# Altium project STM32DRONE.PrjPcb
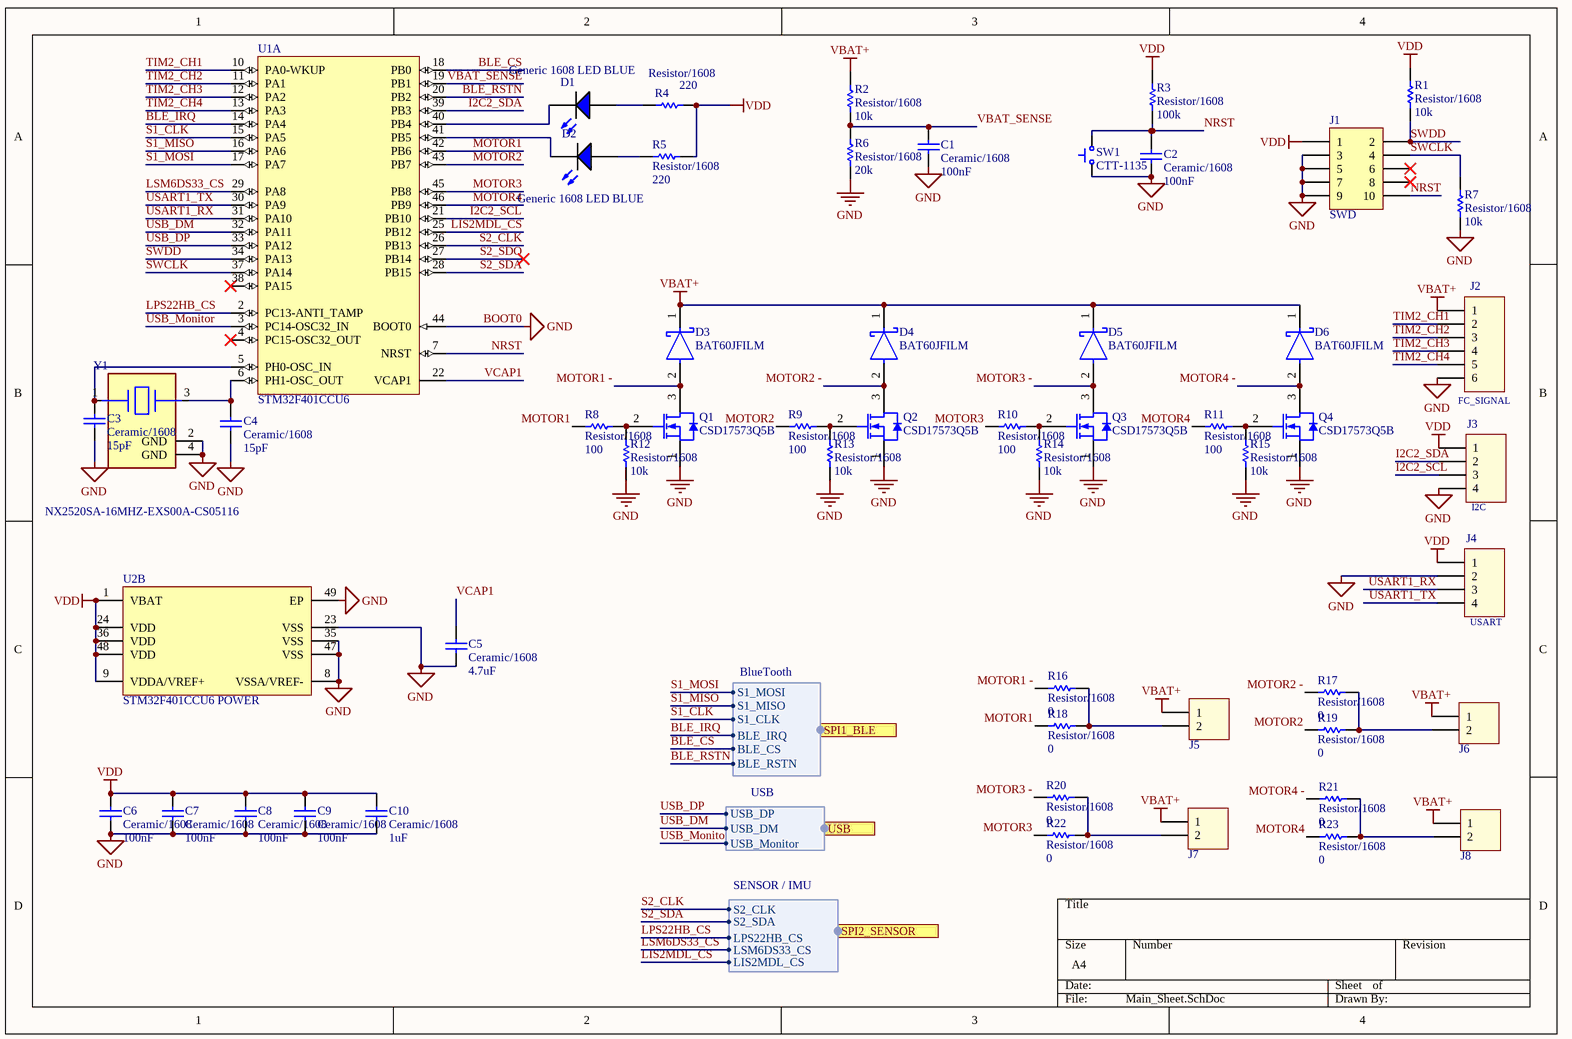
[diagram p0: Main_Sheet.SchDoc]
4 sheets, 89 parts. Net scope: flat (ports and power ports of the same name join across sheets).
Board file: PCB1.PcbDoc
Sheets:
  Main_Sheet.SchDoc
  SPBTLE-RF_BlueTooth_Module.SchDoc
  USB_BAT.SchDoc
  Sensor.SchDoc

## Sheet Main_Sheet.SchDoc
size A4; SheetNumber: 1; SheetTotal: 4

### Parts
C1  Ceramic/1608  value 100nF  [Generic 1608 Ceramic]
C2  Ceramic/1608  value 100nF  [Generic 1608 Ceramic]
C3  Ceramic/1608  value 15pF  [Generic 1608 Ceramic]
C4  Ceramic/1608  value 15pF  [Generic 1608 Ceramic]
C5  Ceramic/1608  value 4.7uF  [Generic 1608 Ceramic]
C6  Ceramic/1608  value 100nF  [Generic 1608 Ceramic]
C7  Ceramic/1608  value 100nF  [Generic 1608 Ceramic]
C8  Ceramic/1608  value 100nF  [Generic 1608 Ceramic]
C9  Ceramic/1608  value 100nF  [Generic 1608 Ceramic]
C10  Ceramic/1608  value 1uF  [Generic 1608 Ceramic]
D1  Generic 1608 LED BLUE  [Generic 1608 LED BLUE-Footprint-1]
D2  Generic 1608 LED BLUE  [Generic 1608 LED BLUE-Footprint-1]
D3  BAT60JFILM  [FP-BAT60JFILM-MFG]
D4  BAT60JFILM  [FP-BAT60JFILM-MFG]
D5  BAT60JFILM  [FP-BAT60JFILM-MFG]
D6  BAT60JFILM  [FP-BAT60JFILM-MFG]
J1  SWD  [3220-10-0300-00-Footprint-1]
J2  FC_SIGNAL  [61300611121]
J3  I2C  [61300411121]
J4  USART  [61300411121]
J5  61300211121  [61300211121]  (value not drawn)
J6  61300211121  [61300211121]  (value not drawn)
J7  61300211121  [61300211121]  (value not drawn)
J8  61300211121  [61300211121]  (value not drawn)
Q1  CSD17573Q5B  [CSD16342Q5A-Footprint-1]
Q2  CSD17573Q5B  [CSD16342Q5A-Footprint-1]
Q3  CSD17573Q5B  [CSD16342Q5A-Footprint-1]
Q4  CSD17573Q5B  [CSD16342Q5A-Footprint-1]
R1  Resistor/1608  value 10k  [Resistor 1608-Footprint]
R2  Resistor/1608  value 10k  [Resistor 1608-Footprint]
R3  Resistor/1608  value 100k  [Resistor 1608-Footprint]
R4  Resistor/1608  value 220  [Resistor 1608-Footprint]
R5  Resistor/1608  value 220  [Resistor 1608-Footprint]
R6  Resistor/1608  value 20k  [Resistor 1608-Footprint]
R7  Resistor/1608  value 10k  [Resistor 1608-Footprint]
R8  Resistor/1608  value 100  [Resistor 1608-Footprint]
R9  Resistor/1608  value 100  [Resistor 1608-Footprint]
R10  Resistor/1608  value 100  [Resistor 1608-Footprint]
R11  Resistor/1608  value 100  [Resistor 1608-Footprint]
R12  Resistor/1608  value 10k  [Resistor 1608-Footprint]
R13  Resistor/1608  value 10k  [Resistor 1608-Footprint]
R14  Resistor/1608  value 10k  [Resistor 1608-Footprint]
R15  Resistor/1608  value 10k  [Resistor 1608-Footprint]
R16  Resistor/1608  value 0  [Resistor 1608-Footprint]
R17  Resistor/1608  value 0  [Resistor 1608-Footprint]
R18  Resistor/1608  value 0  [Resistor 1608-Footprint]
R19  Resistor/1608  value 0  [Resistor 1608-Footprint]
R20  Resistor/1608  value 0  [Resistor 1608-Footprint]
R21  Resistor/1608  value 0  [Resistor 1608-Footprint]
R22  Resistor/1608  value 0  [Resistor 1608-Footprint]
R23  Resistor/1608  value 0  [Resistor 1608-Footprint]
SW1  CTT-1135  [CTT-1135-Footprint-1]
U1  STM32F401CCU6  [STM-UFQFPN48_N]  (part A of 2)
U2  STM32F401CCU6 POWER  [STM-UFQFPN48_N]  (part B of 2)
Y1  NX2520SA-16MHZ-EXS00A-CS05116  [FP-NX2520SA-MFG]

### Ports
SPI1_BLE (harness BlueTooth), SPI2_SENSOR (harness SENSOR / IMU), USB (harness USB)

### Harnesses
BlueTooth: S1_CLK, S1_MISO, S1_MOSI, BLE_IRQ, BLE_CS, BLE_RSTN
USB: USB_DM, USB_DP, USB_Monitor
SENSOR / IMU: LPS22HB_CS, S2_SDA, S2_CLK, LSM6DS33_CS, LIS2MDL_CS

### Nets
BOOT0: C1.1 C2.1 C3.1 C4.1 C5.1 C6.1 C6.2 C7.1 C7.2 C8.1 C8.2 C9.1 C9.2 C10.1 C10.2 J1.1 J1.3 J1.5 J1.7 J1.9 J2.6 J3.1 J3.4 J4.1 J4.2 Q1.1(S) Q2.1(S) Q3.1(S) Q4.1(S) R1.2 R3.2 R4.2 R5.2 R6.1 R7.1 R12.1 R13.1 R14.1 R15.1 SW1.1 U1.44(BOOT0) U2.1(VBAT) U2.8(VSSA/VREF-) U2.9(VDDA/VREF+) U2.23(VSS) U2.24(VDD) U2.35(VSS) U2.36(VDD) U2.47(VSS) U2.48(VDD) U2.49(EP) Y1.2(GND) Y1.4(GND)  [also labelled GND, VDD]
VBAT+: D3.1(K) D4.1(K) D5.1(K) D6.1(K) J2.1 J5.1 J6.1 J7.1 J8.1 R2.2
BLE_CS: U1.18(PB0) ; port SPI1_BLE.BLE_CS
BLE_IRQ: U1.14(PA4) ; port SPI1_BLE.BLE_IRQ
BLE_RSTN: U1.20(PB2) ; port SPI1_BLE.BLE_RSTN
I2C2_SCL: J3.3 U1.21(PB10)
I2C2_SDA: J3.2 U1.39(PB3)
LIS2MDL_CS: U1.25(PB12) ; port SPI2_SENSOR.LIS2MDL_CS
LPS22HB_CS: U1.2(PC13-ANTI_TAMP) ; port SPI2_SENSOR.LPS22HB_CS
LSM6DS33_CS: U1.29(PA8) ; port SPI2_SENSOR.LSM6DS33_CS
MOTOR1: R8.1 R18.1 U1.42(PB6)
MOTOR1 -: D3.2(A) Q1.3(D) R16.1
MOTOR2: R9.1 R19.1 U1.43(PB7)
MOTOR2 -: D4.2(A) Q2.3(D) R17.1
MOTOR3: R10.1 R22.1 U1.45(PB8)
MOTOR3 -: D5.2(A) Q3.3(D) R20.1
MOTOR4: R11.1 R23.1 U1.46(PB9)
MOTOR4 -: D6.2(A) Q4.3(D) R21.1
NRST: C2.2 J1.10 R3.1 SW1.2 U1.7(NRST)
S1_CLK: U1.15(PA5) ; port SPI1_BLE.S1_CLK  [project net CLK]
S1_MISO: U1.16(PA6) ; port SPI1_BLE.S1_MISO  [project net MISO]
S1_MOSI: U1.17(PA7) ; port SPI1_BLE.S1_MOSI  [project net MOSI]
S2_CLK: U1.26(PB13) ; port SPI2_SENSOR.S2_CLK
S2_SDA: U1.28(PB15) ; port SPI2_SENSOR.S2_SDA
S2_SDO: U1.27(PB14)
SWCLK: J1.4 R7.2 U1.37(PA14)
SWDD: J1.2 R1.1 U1.34(PA13)
TIM2_CH1: J2.2 U1.10(PA0-WKUP)
TIM2_CH2: J2.3 U1.11(PA1)
TIM2_CH3: J2.4 U1.12(PA2)
TIM2_CH4: J2.5 U1.13(PA3)
USART1_RX: J4.3 U1.31(PA10)
USART1_TX: J4.4 U1.30(PA9)
USB_DM: U1.32(PA11) ; port USB.USB_DM
USB_DP: U1.33(PA12) ; port USB.USB_DP
USB_Monitor: U1.3(PC14-OSC32_IN) ; port USB.USB_Monitor
VBAT_SENSE: C1.2 R2.1 R6.2 U1.19(PB1)
VCAP1: C5.2 U1.22(VCAP1)
NetC3_2: C3.2 U1.5(PH0-OSC_IN) Y1.1
NetC4_2: C4.2 U1.6(PH1-OSC_OUT) Y1.3
NetD1_1: D1.1(A) R4.1
NetD1_2: D1.2(K) U1.40(PB4)
NetD2_1: D2.1(A) R5.1
NetD2_2: D2.2(K) U1.41(PB5)
NetJ5_2: J5.2 R16.2 R18.2
NetJ6_2: J6.2 R17.2 R19.2
NetJ7_2: J7.2 R20.2 R22.2
NetJ8_2: J8.2 R21.2 R23.2
NetQ1_2: Q1.2(G) R8.2 R12.2
NetQ2_2: Q2.2(G) R9.2 R13.2
NetQ3_2: Q3.2(G) R10.2 R14.2
NetQ4_2: Q4.2(G) R11.2 R15.2

Not connected (* = marked no-connect by the designer): J1 6* 8*; U1 4(PC15-OSC32_OUT)* 38(PA15)*

### Library data of the parts
C1-C10 = CMP-002-0009-3: Generic 1608 Ceramic Capacitor; Capacitor Type: Ceramic; Pins: 2; Mount: SMD; Case/Package: 1608; RoHS: Yes
D1 D2 = CMP-008-0003-2: Generic 1608 LED <BLUE>
D3-D6 = CMP-12187-000028-1: DIODE SCHOTTKY 10V 3A SOD323; Max Forward Surge Current (Ifsm): 5A; Forward Voltage: 580mV; Max Reverse Leakage Current: 7.5uA; Element Configuration: Single; Polarity: Standard; Output Current: 3A; Contact Plating: Tin; Package Quantity: 1; Mount: Surface Mount; Min Operating Temperature: -65°C; Average Rectified Current: 3A; Packaging: Tape and Reel; Forward Current: 3A; Height: 1.07mm; Length: 1.8mm; REACH SVHC: No SVHC; Peak Non-Repetitive Surge Current: 5A; Max Surge Current: 5A; Width: 1.45mm; Current Rating: 3A; Lead Free: Lead Free; Radiation Hardening: No; Max Reverse Voltage (DC): 10V; Peak Reverse Current: 7.5uA; Voltage Rating (DC): 10V; Max Operating Temperature: 150°C; Max Repetitive Reverse Voltage (Vrrm): 10V; Number of Pins: 2; Weight: 0.01lb
J1 = CMP-ROOT-00062-1: CONN HEADER SMD 10POS 1.27MM; Pitch: 0.05inch; Number of Positions: 10; Connector Type: Male Pin; Mount: Surface Mount; Packaging: Tray; Contact Plating: Gold; Termination: Solder; Number of Rows: 2; RoHS: Yes; Package Quantity: 3200; Row Spacing: 0.05inch
J2 = CMP-005-0062-1: Pin Header WR-PHD, pitch 2.54 mm, THT, Vertical, single row, 6 pin; Contact Resistance: 20 mOhm; Insulation Resistance: >1000 MOhm; Pin Number: 6; Pitch: 2.54 mm; Rated Current: 3 A; Working Voltage: 250 VAC; Component Name: 61300611121; ComponentLink1Description: Manufacturer; ComponentLink1URL: http://www.we-online.de; ComponentLink2Description: Datasheet; ComponentLink2URL: http://katalog.we-online.de/em/datasheet/6130xx11121.pdf; Designator: 61300611121; Mounting Technology: THT; Operating Temperature: -40 to 105 degC; Orientation: Vertical; Part Number: 61300611121; Pin Count: 6; Published Date: Jan. 2018; Publisher: Wurth Elektronik; Row Number: Single
J3 J4 = CMP-005-0056-1: Pin Header WR-PHD, pitch 2.54 mm, THT, Vertical, single row, 4 pin; Contact Resistance: 20 mOhm; Insulation Resistance: >1000 MOhm; Pin Number: 4; Pitch: 2.54 mm; Rated Current: 3 A; Working Voltage: 250 VAC; Component Name: 61300411121; ComponentLink1Description: Manufacturer; ComponentLink1URL: http://www.we-online.de; ComponentLink2Description: Datasheet; ComponentLink2URL: http://katalog.we-online.de/em/datasheet/6130xx11121.pdf; Designator: 61300411121; Mounting Technology: THT; Operating Temperature: -40 to 105 degC; Orientation: Vertical; Part Number: 61300411121; Pin Count: 4; Published Date: Jan. 2018; Publisher: Wurth Elektronik; Row Number: Single
J5-J8 = CMP-005-0052-1: Pin Header WR-PHD, pitch 2.54 mm, THT, Vertical, single row, 2 pin; Contact Resistance: 20 mOhm; Insulation Resistance: >1000 MOhm; Pin Number: 2; Pitch: 2.54 mm; Rated Current: 3 A; Working Voltage: 250 VAC; Component Name: 61300211121; ComponentLink1Description: Manufacturer; ComponentLink1URL: http://www.we-online.de; ComponentLink2Description: Datasheet; ComponentLink2URL: http://katalog.we-online.de/em/datasheet/6130xx11121.pdf; Designator: 61300211121; Mounting Technology: THT; Operating Temperature: -40 to 105 degC; Orientation: Vertical; Part Number: 61300211121; Pin Count: 2; Published Date: Jan. 2018; Publisher: Wurth Elektronik; Row Number: Single
Q1-Q4 = CMP-014-0005-2: Trans MOSFET N-CH 30V 100A 8-Pin SON T/R; pin to pad: 1>1+2+3 2>4 3>5+6+7+8; Turn-On Delay Time: 6ns; Max Power Dissipation: 3.2W; Rds On Max: 1mR; Turn-Off Delay Time: 40ns; Gate to Source Voltage (Vgs): 20V; Input Capacitance: 9nF; Element Configuration: Single; Rise Time: 20ns; Fall Time: 7ns; Max Operating Temperature: 150°C; Contact Plating: Nickel, Gold; Mount: Surface Mount; Lead Free: Contains Lead; Number of Pins: 8; Drain to Source Voltage (Vdss): 30V; Continuous Drain Current (ID): 100A; Packaging: Tape and Reel; Min Operating Temperature: -55°C
R1-R23 = CMP-001-0018-2: Generic 1608 Resistor; Pins: 2; Case/Package: Bulk; RoHS: Yes; Mount: SMD
SW1 = CMP-013-0003-1: 3.9x2.9x2.0 SMD  Tact switch; RoHS: Yes; Case/Package: 3.9x2.9x2.0; Mount: SMD; Pins: 2
U1 U2 = CMP-0243-00119-2: ARM Cortex-M4 32-bit MCU+FPU, 105 DMIPS, 256 kB Flash, 64 kB Internal RAM, 36 I/Os, 48-pin UFQFPN, -40 to 85 degC, Tray; Manufacturer: STMicroelectronics; Supply Voltage(Vcc) max (V): 3.6; I/Os (High Current): 36; Internal RAM Size (kB): 64; Operating Frequency(F) (Processor speed) (MHz): 84; FLASH Size (Prog) (kB): 256; Supply Voltage(Vcc) min (V): 1.8; Packing: Tray; PackageReference: UFQFPN48; PackageVersion: Rev. 1, 04/2013; Core: ARM Cortex-M4; ComponentLink1Description: Manufacturer URL; ComponentLink3Description: Package Specification; PackageDescription: 48-Pin Ultra Thin Fine Pitch Quad Flat No-Lead, 7 x 7 x 0.6 mm Body, 0.5 mm Pitch, Exposed Pad; Mounting Technology: Surface Mount; ComponentLink2URL: http://www.st.com/st-web-ui/static/active/en/resource/technical/document/data_brief/DM00071938.pdf; DatasheetVersion: Rev. 1; ComponentLink2Description: Datasheet; ComponentLink1URL: http://www.st.com/web/en/home.html; PartNumber: STM32F401CCU6; ComponentLink3URL: http://www.st.com/st-web-ui/static/active/en/resource/technical/document/data_brief/DM00071938.pdf
Y1 = CMP-2000-05279-2: CRYSTAL 16.0000MHZ 12PF SMD; Series Resistance: 80R; Frequency: 16MHz; Frequency Tolerance: 15ppm; Frequency Stability: 25ppm; Mount: Surface Mount; Height: 0.022inch; Length: 0.098inch; ESR (Equivalent Series Resistance): 80R; Packaging: Tape and Reel; Min Operating Temperature: -40°C; Width: 0.079inch; Number of Pins: 4; Case/Package: SMD/SMT; Max Operating Temperature: 85°C; Load Capacitance: 12pF; Package Quantity: 3000

## Sheet SPBTLE-RF_BlueTooth_Module.SchDoc
size A4; SheetNumber: 2; SheetTotal: 4
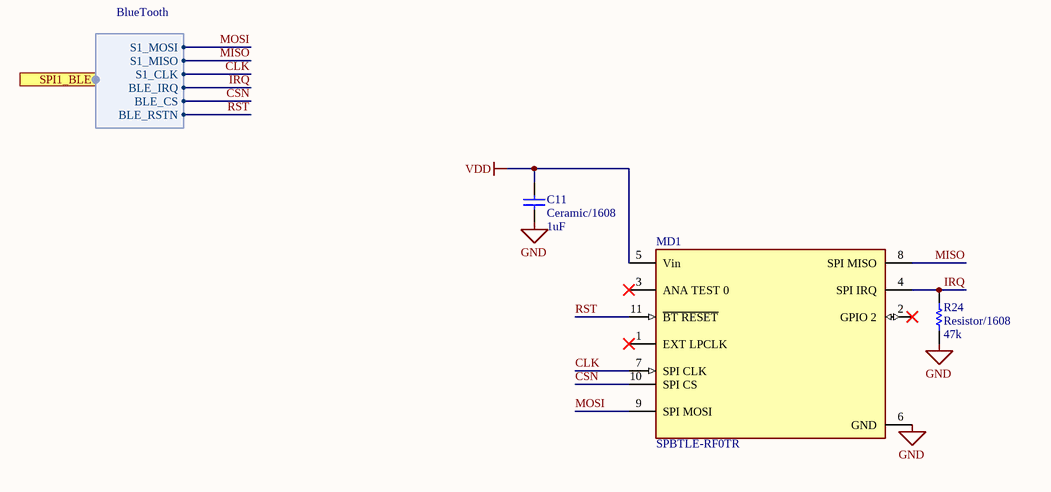
[diagram p1: SPBTLE-RF_BlueTooth_Module.SchDoc]

### Parts
C11  Ceramic/1608  value 1uF  [Generic 1608 Ceramic]
MD1  SPBTLE-RF0TR  [FP-SPBTLE-RF0TR-MFG]
R24  Resistor/1608  value 47k  [Resistor 1608-Footprint]

### Ports
SPI1_BLE (harness BlueTooth)

### Harnesses
BlueTooth: S1_CLK, S1_MISO, S1_MOSI, BLE_IRQ, BLE_CS, BLE_RSTN

### Nets
GND: C11.1 C11.2 MD1.5(Vin) MD1.6(GND) R24.1  [also labelled VDD]  [project net BOOT0]
CLK: MD1.7(SPI_CLK) ; port SPI1_BLE.S1_CLK
CSN: MD1.10(SPI_CS) ; port SPI1_BLE.BLE_CS  [project net BLE_CS]
IRQ: MD1.4(SPI_IRQ) R24.2 ; port SPI1_BLE.BLE_IRQ  [project net BLE_IRQ]
MISO: MD1.8(SPI_MISO) ; port SPI1_BLE.S1_MISO
MOSI: MD1.9(SPI_MOSI) ; port SPI1_BLE.S1_MOSI
RST: MD1.11(~{BT_RESET}) ; port SPI1_BLE.BLE_RSTN  [project net BLE_RSTN]

Not connected (* = marked no-connect by the designer): MD1 1(EXT_LPCLK)* 2(GPIO_2)* 3(ANA_TEST_0)*

### Library data of the parts
C11 = CMP-002-0009-3: Generic 1608 Ceramic Capacitor; Capacitor Type: Ceramic; Pins: 2; Mount: SMD; Case/Package: 1608; RoHS: Yes
MD1 = CMP-12160-000004-1: MOD VLP BLUETOOTH REV V4.1; Manufacturer: STMicroelectronics; Sensitivity: -88dBm; Nominal Supply Current: 0.186-14.49mA; Number Of Gpio: 1; Max Frequency: 2480MHz; Interface: SPI; Max Supply Voltage: 3.6V; Min Supply Voltage: 1.7V; Category: UNK; ComponentLink2URL: https://www.st.com/resource/en/datasheet/spbtle-rf0.pdf; Temperature Range Low: -40°C; Package: SPBTLE-RF0TR; Lead Free: Yes; Device Class L3: Transceivers; RoHS: TRUE; Height: 2.2mm; Manufacturer Part Number: SPBTLE-RF0TR; Temperature Range High: +85°C; ComponentLink2Description: Datasheet; Device Class L2: RF Semiconductors and Devices; Automotive: No; Device Class L1: Integrated Circuits (ICs); Digikey Description: MOD VLP BLUETOOTH REV V4.1; Octopart: https://octopart.com/spbtle-rf0tr-stmicroelectronics-87775406; Temperature: -40°C to +85°C
R24 = CMP-001-0018-2: Generic 1608 Resistor; Pins: 2; Case/Package: Bulk; RoHS: Yes; Mount: SMD

## Sheet USB_BAT.SchDoc
size A4; SheetNumber: 3; SheetTotal: 4
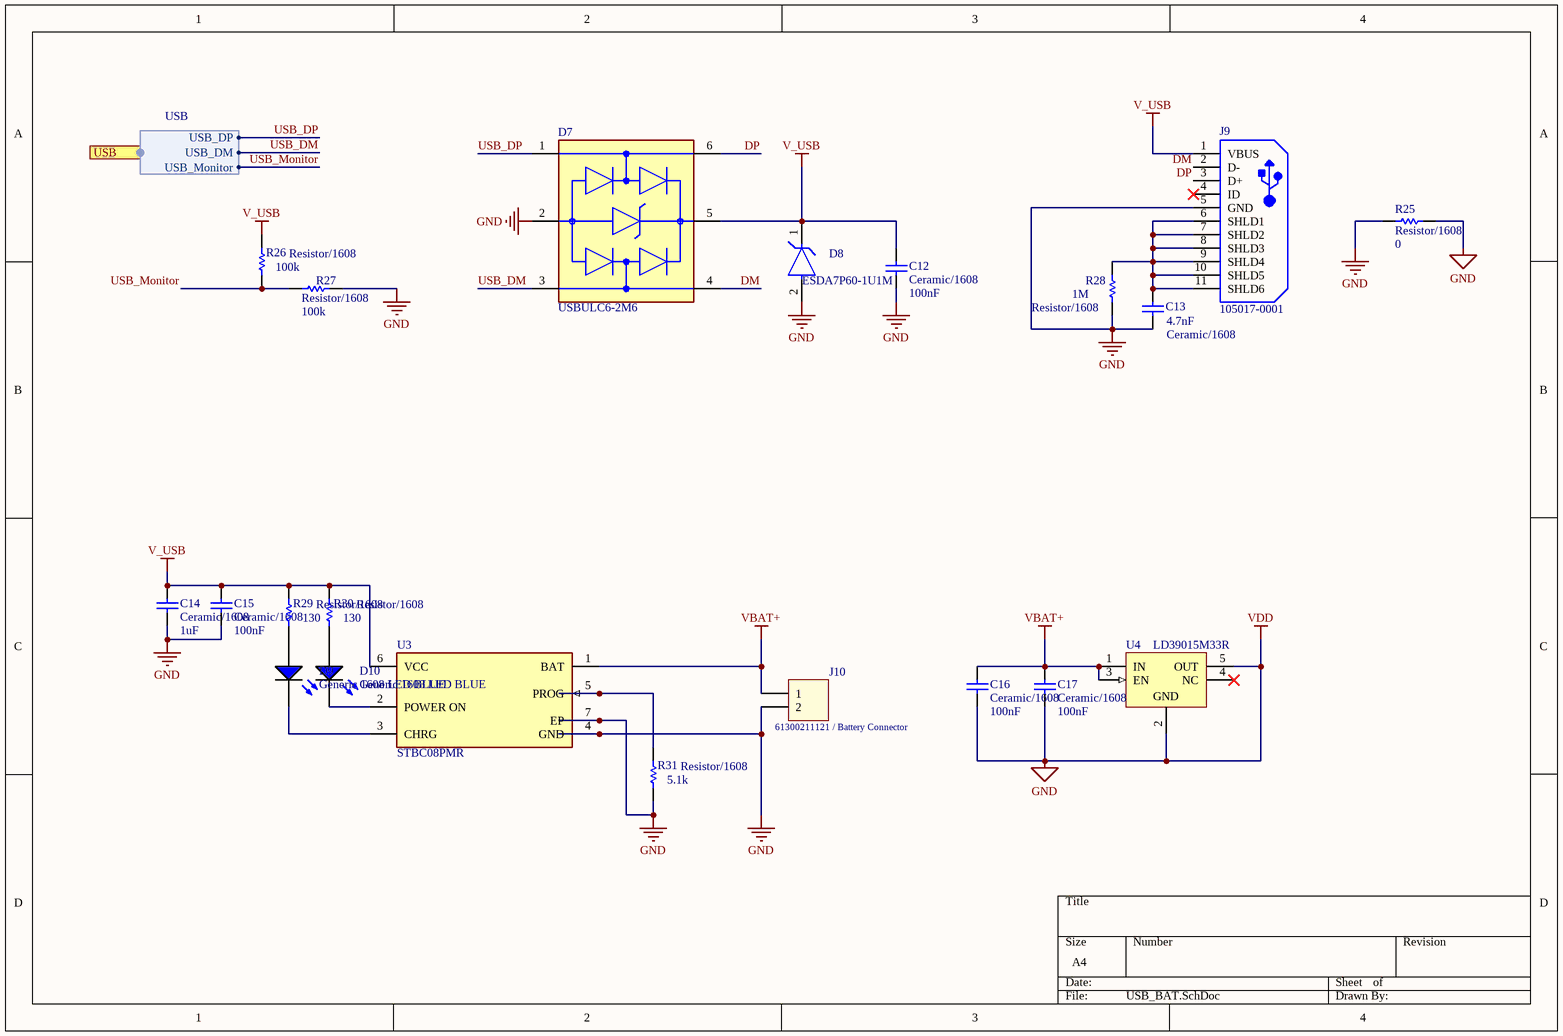
[diagram p2: USB_BAT.SchDoc]

### Parts
C12  Ceramic/1608  value 100nF  [Generic 1608 Ceramic]
C13  Ceramic/1608  value 4.7nF  [Generic 1608 Ceramic]
C14  Ceramic/1608  value 1uF  [Generic 1608 Ceramic]
C15  Ceramic/1608  value 100nF  [Generic 1608 Ceramic]
C16  Ceramic/1608  value 100nF  [Generic 1608 Ceramic]
C17  Ceramic/1608  value 100nF  [Generic 1608 Ceramic]
D7  USBULC6-2M6  [FP-QFN_1_45x1_00_6L-MFG]
D8  ESDA7P60-1U1M  [FP-1610-MFG]
D9  Generic 1608 LED BLUE  [Generic 1608 LED BLUE-Footprint-1]
D10  Generic 1608 LED BLUE  [Generic 1608 LED BLUE-Footprint-1]
J9  105017-0001  [USB-MICRO-B_V]
J10  61300211121 / Battery Connector  [61300211121]
R25  Resistor/1608  value 0  [Resistor 1608-Footprint]
R26  Resistor/1608  value 100k  [Resistor 1608-Footprint]
R27  Resistor/1608  value 100k  [Resistor 1608-Footprint]
R28  Resistor/1608  value 1M  [Resistor 1608-Footprint]
R29  Resistor/1608  value 130  [Resistor 1608-Footprint]
R30  Resistor/1608  value 130  [Resistor 1608-Footprint]
R31  Resistor/1608  value 5.1k  [Resistor 1608-Footprint]
U3  STBC08PMR  [FP-DFN6-7946637-IPC_A]
U4  LD39015M33R  [SOT23-5L_M]

### Ports
USB (harness USB)

### Harnesses
USB: USB_DM, USB_DP, USB_Monitor

### Nets
GND: C12.1 C13.1 C14.1 C15.1 C16.1 C17.1 D7.2 D8.2(A) J9.5(GND) J10.2 R25.1 R25.2 R27.1 R28.1 R31.1 U3.4(GND) U3.7(EP) U4.2(GND) U4.5(OUT)  [also labelled VDD]  [project net BOOT0]
V_USB: C12.2 C14.2 C15.2 D7.5 D8.1(C) J9.1(VBUS) R26.2 R29.2 R30.2 U3.6(VCC)
VBAT+: C16.2 C17.2 J10.1 U3.1(BAT) U4.1(IN) U4.3(EN)
DM: D7.4(I/O2) J9.2(D-)
DP: D7.6(I/O1) J9.3(D+)
USB_DM: D7.3(I/O2) ; port USB.USB_DM
USB_DP: D7.1(I/O1) ; port USB.USB_DP
USB_Monitor: R26.1 R27.2 ; port USB.USB_Monitor
NetC13_2: C13.2 J9.6(SHLD1) J9.7(SHLD2) J9.8(SHLD3) J9.9(SHLD4) J9.10(SHLD5) J9.11(SHLD6) R28.2
NetD9_1: D9.1(A) R29.1
NetD9_2: D9.2(K) U3.3(CHRG)
NetD10_1: D10.1(A) R30.1
NetD10_2: D10.2(K) U3.2(POWER_ON)
NetR31_2: R31.2 U3.5(PROG)

Not connected (* = marked no-connect by the designer): J9 4(ID)*; U4 4(NC)*

### Library data of the parts
C12 C14-C17 = CMP-002-0009-3: Generic 1608 Ceramic Capacitor; Capacitor Type: Ceramic; Pins: 2; Mount: SMD; Case/Package: 1608; RoHS: Yes
C13 = CMP-002-0009-3: Generic 1608 Ceramic Capacitor / 50V; Capacitor Type: Ceramic; Pins: 2; Mount: SMD; Case/Package: 1608; RoHS: Yes
D7 = CMP-12225-000002-1: TVS DIODE 5V 17V 6UQFN; Manufacturer: STMicroelectronics; Breakdown Voltage: 6V; Direction: Unidirectional; Capacitance: 0.65pF; Number Of Channels: 2; Max Junction Temp: +150°C; Value: 0.65pF; Standoff Height: 0mm; Package: QFN_1.45x1.00_6L; Digikey Description: TVS DIODE 5V 17V 6UQFN; Temperature Range High: +150°C; Device Class L2: TVS Diodes; ComponentLink2Description: Datasheet; Device Class L1: Circuit Protection; Temperature: to +150°C; RoHS: TRUE; Ipc Land Pattern Name: DFN145X100X57-6; Manufacturer Part Number: USBULC6-2M6; Category: Diode; Automotive: No; ComponentLink2URL: https://www.st.com/resource/en/datasheet/usbulc6-2m6.pdf; Lead Free: Yes; Device Class L3: unset; Clamping Voltage: 17V; Mouser Description: ESD Suppressors ULTRA LG BANDWIDTH ESD PROTECTION; Octopart: https://octopart.com/usbulc6-2m6-stmicroelectronics-7979994; Height: 0.65mm
D8 = CMP-12225-000013-1: TVS DIODE 5V 11.6V 1610; Manufacturer: STMicroelectronics; Number Of Channels: 1; Standoff Height: 0mm; Breakdown Voltage: 6.4V; Direction: Unidirectional; Clamping Voltage: 10.2V; Peak Pulse Power: 700W; Peak Pulse Current: 60A; Max Junction Temp: +150°C; ComponentLink2Description: Datasheet; Temperature Range Low: -55°C; Package: 1610; Lead Free: Yes; Temperature Range High: +150°C; Temperature: -55°C to +150°C; Device Class L2: TVS Diodes; Category: Diode; Device Class L1: Circuit Protection; Manufacturer Part Number: ESDA7P60-1U1M; Digikey Description: TVS DIODE 5V 11.6V 1610; ComponentLink2URL: http://www.st.com/content/ccc/resource/technical/document/datasheet/44/e9/26/44/42/ee/4f/e5/DM00139972.pdf/files/DM00139972.pdf/jcr:content/translations/en.DM00139972.pdf; Reverse Standoff Voltage: 5V; RoHS: TRUE; Octopart: https://octopart.com/esda7p60-1u1m-stmicroelectronics-52112702; Height: 0.65mm; Device Class L3: unset; Automotive: No
D9 D10 = CMP-008-0003-2: Generic 1608 LED <BLUE>
J9 = CMP-2000-05827-1: Micro-USB B Receptacle, Right Angle, Bottom Mount, Surface Mount, with Solder Tabs, -30 to 85 degC, 5-Pin USB, RoHS, Tape and Reel; Manufacturer: Molex; Featured Product: Micro-USBConnectorsUSBConnectors; Other Names: WM1399DKR; Package Version: Rev. F, 12/2012; Number of Contacts: 5; Connector Type: USB-microB; Catalog Drawings: 1050170001; 3D Model: 105017-0001.stp; Mating Products: WM17145-ND-CABLEMICROUSBBTOSTDA1.0MWM17147-ND-CABLEMICROUSBBTOSTDA2.0MWM17146-ND-CABLEMICROUSBBTOSTDA1.5M; PCN Assembly/Origin: ResinSupplier21/Oct/2015; Voltage - Max: 30V; Online Catalog: Molex-MicroUSB; Manufacturer URL: http://www.molex.com/; Package Description: 5-Leads USB, Micro B, Body 7.5 x 5 mm, Pitch 0.65 mm; Datasheet URL: http://www.molex.com/elqNow/elqRedir.htm?ref=http://www.molex.com/webdocs/datasheets/pdf/en-us/1050170001_IO_CONNECTORS.pdf; Ingress Protection: -; Datasheet Version: 03/2016; Mounting Type: BoardCutout,SurfaceMount,RightAngle; Circuits: 5; Standard Package: 1; Package Reference: MICRO-B; Package URL: http://www.molex.com/pdm_docs/sd/1050170001_sd.pdf; Category: Connectors,Interconnects; Series: -; RoHS Information: 1050170001CertofCompliance; Features: Shielded,SolderRetention; Family: USB,DVI,HDMIConnectors; Specifications: -; Gender: Receptacle; Packaging: Digi-Reel®; Mounting Technology: SurfaceMount
J10 = CMP-005-0052-1: as J5 on sheet Main_Sheet; Component Name: 61300211121; ComponentLink1Description: Manufacturer; ComponentLink1URL: http://www.we-online.de; ComponentLink2Description: Datasheet; ComponentLink2URL: http://katalog.we-online.de/em/datasheet/6130xx11121.pdf; Designator: 61300211121; Mounting Technology: THT; Operating Temperature: -40 to 105 degC; Orientation: Vertical; Part Number: 61300211121; Pin Count: 2; Published Date: Jan. 2018; Publisher: Wurth Elektronik; Row Number: Single
R25-R31 = CMP-001-0018-2: Generic 1608 Resistor; Pins: 2; Case/Package: Bulk; RoHS: Yes; Mount: SMD
U3 = CMP-12147-000003-2: IC BATT CHRGR LI-ION 800MA DFN6; Max Input Voltage: 10V; Min Supply Voltage: 4.25V; Min Output Voltage: 4.158V; Max Output Voltage: 4.242V; Number of Channels: 1; Max Supply Voltage: 6.5V; Output Voltage: 4.2V; Case/Package: DFN; Length: 3.1mm; Width: 3.1mm; Packaging: Tape and Reel; Output Current: 800mA; Min Operating Temperature: -40°C; Mount: Surface Mount; Height: 0.95mm; Radiation Hardening: No; Lead Free: Lead Free; Max Output Current: 800mA; Max Operating Temperature: 85°C; Number of Pins: 6; Package Quantity: 1
U4 = CMP-0244-00351-1: 150 mA Low Quiescent Current Low Noise Voltage Regulator, 3.3V, 5-Pin SOT-23, Tape and Reel; PackageReference: SOT23-5L; ComponentLink1URL: http://www.st.com; PackageDescription: 5-Pin SOT-23 Package, 2.9 x 1.6 mm Body, 0.95 mm Pitch, 2.8 mm Lead Span; ComponentLink2Description: Datasheet; DatasheetVersion: 1/02/2009; ComponentLink1Description: Manufacturer URL; ComponentLink2URL: http://www.st.com/internet/com/TECHNICAL_RESOURCES/TECHNICAL_LITERATURE/DATASHEET/CD00173477.pdf; PackageVersion: 1/01/2008

## Sheet Sensor.SchDoc
size A4; SheetNumber: 4; SheetTotal: 4
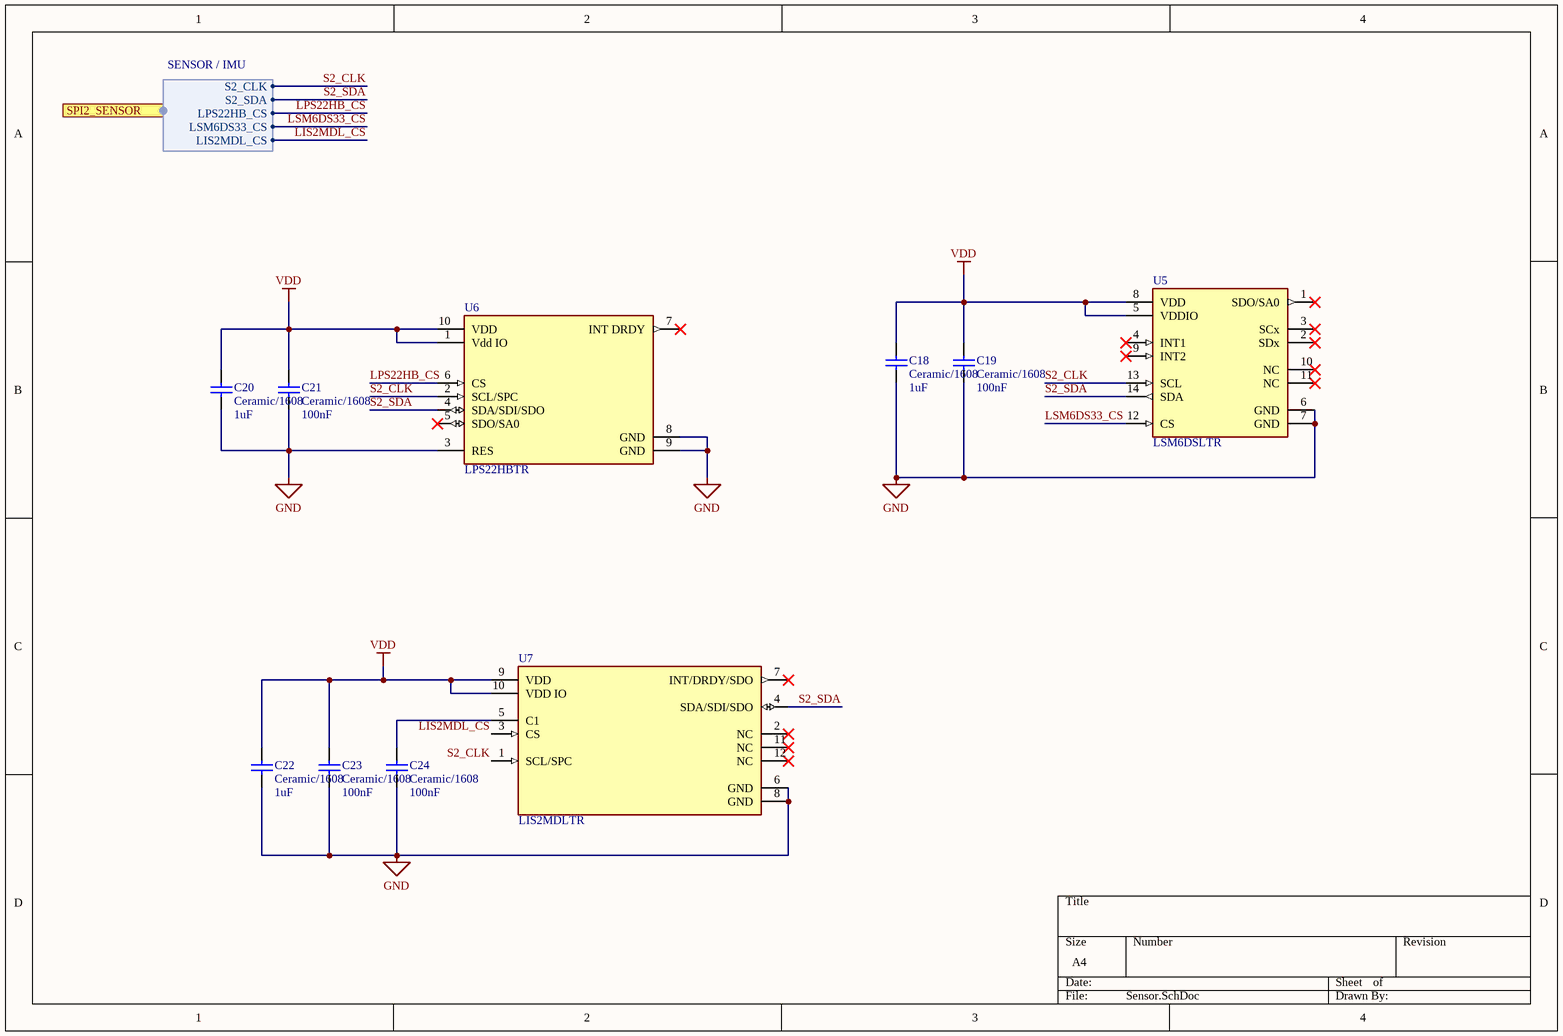
[diagram p3: Sensor.SchDoc]

### Parts
C18  Ceramic/1608  value 1uF  [Generic 1608 Ceramic]
C19  Ceramic/1608  value 100nF  [Generic 1608 Ceramic]
C20  Ceramic/1608  value 1uF  [Generic 1608 Ceramic]
C21  Ceramic/1608  value 100nF  [Generic 1608 Ceramic]
C22  Ceramic/1608  value 1uF  [Generic 1608 Ceramic]
C23  Ceramic/1608  value 100nF  [Generic 1608 Ceramic]
C24  Ceramic/1608  value 100nF  [Generic 1608 Ceramic]
U5  LSM6DSLTR  [FP-LGA-14L-DM00249496-MFG]
U6  LPS22HBTR  [FP-HLGA-10L-8479831-0]
U7  LIS2MDLTR  [FP-LGA-12-DM00170568-MFG]

### Ports
SPI2_SENSOR (harness SENSOR / IMU)

### Harnesses
SENSOR / IMU: LPS22HB_CS, S2_SDA, S2_CLK, LSM6DS33_CS, LIS2MDL_CS

### Nets
GND: C18.1 C18.2 C19.1 C19.2 C20.1 C20.2 C21.1 C21.2 C22.1 C22.2 C23.1 C23.2 C24.2 U5.5(VDDIO) U5.6(GND) U5.7(GND) U5.8(VDD) U6.1(Vdd_IO) U6.3(RES) U6.8(GND) U6.9(GND) U6.10(VDD) U7.6(GND) U7.8(GND) U7.9(VDD) U7.10(VDD_IO)  [also labelled VDD]  [project net BOOT0]
LIS2MDL_CS: U7.3(CS) ; port SPI2_SENSOR.LIS2MDL_CS
LPS22HB_CS: U6.6(CS) ; port SPI2_SENSOR.LPS22HB_CS
LSM6DS33_CS: U5.12(CS) ; port SPI2_SENSOR.LSM6DS33_CS
S2_CLK: U5.13(SCL) U6.2(SCL/SPC) U7.1(SCL/SPC) ; port SPI2_SENSOR.S2_CLK
S2_SDA: U5.14(SDA) U6.4(SDA/SDI/SDO) U7.4(SDA/SDI/SDO) ; port SPI2_SENSOR.S2_SDA
NetC24_1: C24.1 U7.5(C1)

Not connected (* = marked no-connect by the designer): U5 1(SDO/SA0)* 2(SDx)* 3(SCx)* 4(INT1)* 9(INT2)* 10(NC)* 11(NC)*; U6 5(SDO/SA0)* 7(INT_DRDY)*; U7 2(NC)* 7(INT/DRDY/SDO)* 11(NC)* 12(NC)*

### Library data of the parts
C18-C24 = CMP-002-0009-3: Generic 1608 Ceramic Capacitor; Capacitor Type: Ceramic; Pins: 2; Mount: SMD; Case/Package: 1608; RoHS: Yes
U5 = CMP-2000-07467-2: IMU ACCEL/GYRO I2C/SPI 14LGA; Manufacturer: STMicroelectronics; Resolution: 16bits; Max Supply Voltage: 3.6V; Sensor Type: Temperature,Accelerometer,Gyroscope; Sensor Output: I2C,SPI; Gyro Range: 125/250/500/1000/2000°/s; Accel Range: 2/4/8/16g; Operating Supply Current: 0.29-0.65mA; Min Supply Voltage: 1.62V; Package: LGA-14L-DM00249496; Temperature Range High: +85°C; Automotive: No; Footprint Url: https://www.st.com/resource/en/technical_note/cd00134799.pdf; Height: 0.86mm; Device Class L1: Sensors; Octopart: https://octopart.com/lsm6dsltr-stmicroelectronics-66358193; Device Class L2: Motion Sensors; Lead Free: Yes; Category: IC; Device Class L3: Inertial Measurement Units (IMUs); ComponentLink2Description: Datasheet; RoHS: TRUE; ComponentLink2URL: https://www.st.com/resource/en/datasheet/lsm6dsl.pdf; Temperature Range Low: -40°C; Manufacturer Part Number: LSM6DSLTR; Mouser Description: iNEMO inertial module: always-on 3D accelerometer and 3D gyroscope; Digikey Description: IMU ACCEL/GYRO I2C/SPI 14LGA; Temperature: -40°C to +85°C
U6 = CMP-12182-000004-1: MEMS NANO PRESSURE SENSOR: 260-1; Manufacturer: STMicroelectronics; Sensor Output: I2C,SPI; Port Style: No Port; Max Supply Voltage: 3.6V; Operating Supply Current: 3-12uA; Min Supply Voltage: 1.7V; Device Class L3: unset; Device Class L1: Sensors; Manufacturer Part Number: LPS22HBTR; Temperature Range High: +85°C; Digikey Description: MEMS NANO PRESSURE SENSOR: 260-1; Device Class L2: Pressure Sensors; RoHS: TRUE; Lead Free: Yes; Height: 0.8mm; Automotive: No; Octopart: https://octopart.com/lps22hbtr-stmicroelectronics-51851131; Package: HLGA-10L-8479831; Temperature Range Low: -40°C; Category: IC; Temperature: -40°C to +85°C; ComponentLink2Description: Datasheet; ComponentLink2URL: https://www.st.com/resource/en/datasheet/lps22hb.pdf; Footprint Url: https://www.st.com/content/ccc/resource/technical/document/technical_note/73/17/9c/16/dd/96/4a/01/CD00134799.pdf/files/CD00134799.pdf/jcr:content/translations/en.CD00134799.pdf
U7 = CMP-12173-000002-1: SENSOR MR I2C/SPI 12LGA; Manufacturer: STMicroelectronics; Sensing Method: Magnetic; Min Supply Voltage: 1.71V; Sensor Output: I2C,SPI; Operating Supply Current: 50-200uA; Max Supply Voltage: 3.6V; Octopart: https://octopart.com/lis2mdltr-stmicroelectronics-81117311; RoHS: TRUE; Device Class L3: unset; Device Class L1: Sensors; ComponentLink2URL: https://www.st.com/resource/en/datasheet/lis2mdl.pdf; Automotive: No; Device Class L2: Magnetic Sensors; Lead Free: Yes; Temperature: -40°C to +85°C; Manufacturer Part Number: LIS2MDLTR; Temperature Range High: +85°C; Height: 0.7mm; Digikey Description: SENSOR MR I2C/SPI 12LGA; Category: IC; ComponentLink2Description: Datasheet; Package: LGA-12-DM00170568; Temperature Range Low: -40°C

## Nets that join several sheets
BOOT0: Main_Sheet (53 pins), SPBTLE-RF_BlueTooth_Module (5 pins), USB_BAT (19 pins), Sensor (26 pins)
VBAT+: Main_Sheet (10 pins), USB_BAT (6 pins)
BLE_CS: Main_Sheet (U1.18), SPBTLE-RF_BlueTooth_Module (MD1.10)
BLE_IRQ: Main_Sheet (U1.14), SPBTLE-RF_BlueTooth_Module (MD1.4 R24.2)
BLE_RSTN: Main_Sheet (U1.20), SPBTLE-RF_BlueTooth_Module (MD1.11)
CLK: Main_Sheet (U1.15), SPBTLE-RF_BlueTooth_Module (MD1.7)
LIS2MDL_CS: Main_Sheet (U1.25), Sensor (U7.3)
LPS22HB_CS: Main_Sheet (U1.2), Sensor (U6.6)
LSM6DS33_CS: Main_Sheet (U1.29), Sensor (U5.12)
MISO: Main_Sheet (U1.16), SPBTLE-RF_BlueTooth_Module (MD1.8)
MOSI: Main_Sheet (U1.17), SPBTLE-RF_BlueTooth_Module (MD1.9)
S2_CLK: Main_Sheet (U1.26), Sensor (U5.13 U6.2 U7.1)
S2_SDA: Main_Sheet (U1.28), Sensor (U5.14 U6.4 U7.4)
USB_DM: Main_Sheet (U1.32), USB_BAT (D7.3)
USB_DP: Main_Sheet (U1.33), USB_BAT (D7.1)
USB_Monitor: Main_Sheet (U1.3), USB_BAT (R26.1 R27.2)